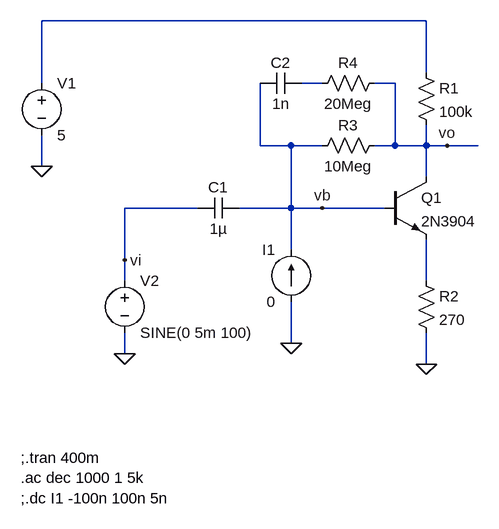
[diagram p0: schematic esfamp_bjt.asc]
esfamp_bjt.asc, the LTspice schematic file:
Version 4
SHEET 1 880 680
WIRE 464 -48 -128 -48
WIRE 464 32 464 -48
WIRE -128 48 -128 -48
WIRE 304 48 272 48
WIRE 416 48 384 48
WIRE 208 144 208 48
WIRE 256 144 208 144
WIRE 304 144 256 144
WIRE 416 144 416 48
WIRE 416 144 384 144
WIRE 464 144 464 112
WIRE 464 144 416 144
WIRE 496 144 464 144
WIRE 544 144 496 144
WIRE -128 176 -128 128
WIRE 464 192 464 144
WIRE 112 240 0 240
WIRE 256 240 256 144
WIRE 256 240 176 240
WIRE 304 240 256 240
WIRE 400 240 304 240
WIRE 256 304 256 240
WIRE 0 320 0 240
WIRE 0 352 0 320
WIRE 464 352 464 288
WIRE 256 448 256 384
WIRE 0 464 0 432
WIRE 464 480 464 432
FLAG -128 176 0
FLAG 464 480 0
FLAG 0 464 0
FLAG 496 144 vo
FLAG 0 320 vi
FLAG 304 240 vb
FLAG 256 448 0
DATAFLAG 544 144 "$"
SYMBOL npn 400 192 R0
SYMATTR InstName Q1
SYMATTR Value 2N3904
SYMBOL Res 448 16 R0
SYMATTR InstName R1
SYMATTR Value 100k
SYMBOL Res 448 336 R0
SYMATTR InstName R2
SYMATTR Value 270
SYMBOL Res 400 128 R90
WINDOW 0 0 56 VBottom 2
WINDOW 3 32 56 VTop 2
SYMATTR InstName R3
SYMATTR Value 10Meg
SYMBOL Cap 176 224 R90
WINDOW 0 0 32 VBottom 2
WINDOW 3 32 32 VTop 2
SYMATTR InstName C1
SYMATTR Value 1µ
SYMBOL voltage -128 32 R0
SYMATTR InstName V1
SYMATTR Value 5
SYMBOL voltage 0 336 R0
SYMATTR InstName V2
SYMATTR Value SINE(0 5m 100)
SYMATTR Value2 AC 1
SYMBOL current 256 384 R180
WINDOW 0 24 80 Left 2
WINDOW 3 24 0 Left 2
SYMATTR InstName I1
SYMATTR Value 0
SYMBOL Res 400 32 R90
WINDOW 0 0 56 VBottom 2
WINDOW 3 32 56 VTop 2
SYMATTR InstName R4
SYMATTR Value 20Meg
SYMBOL Cap 272 32 R90
WINDOW 0 0 32 VBottom 2
WINDOW 3 32 32 VTop 2
SYMATTR InstName C2
SYMATTR Value 1n
TEXT -160 624 Left 2 !;.tran 400m\n.ac dec 1000 1 5k\n;.dc I1 -100n 100n 5n

The netlist it stands for:
* esfamp_bjt.asc
Q1 vo vb N003 0 2N3904
R1 N001 vo 100k
R2 N003 0 270
R3 vo vb 10Meg
C1 vb vi 1µ
V1 N001 0 5
V2 vi 0 SINE(0 5m 100) AC 1
I1 0 vb 0
R4 vo N002 20Meg
C2 N002 vb 1n
.model NPN NPN
.model PNP PNP
.lib standard.bjt
;.tran 400m
.ac dec 1000 1 5k
;.dc I1 -100n 100n 5n
.backanno
.end